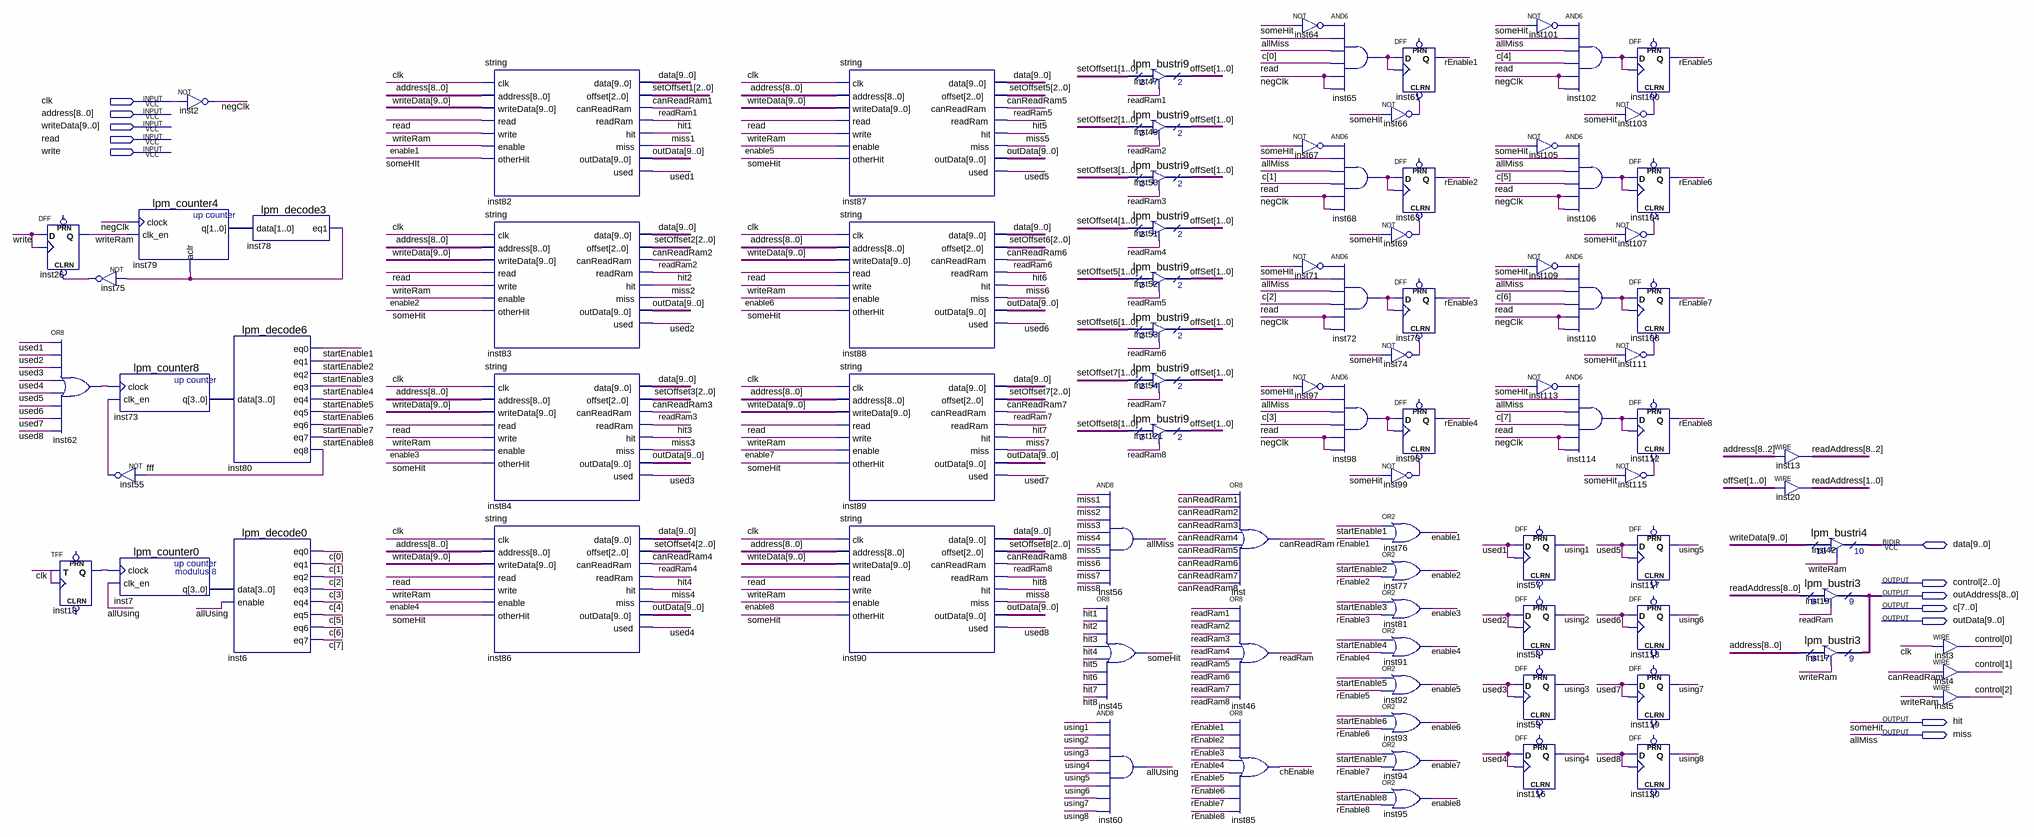
[diagram p0: schematic sheet]
// Quartus schematic Cache.bdf as structural Verilog: 90 symbols, 12 pins
module Cache (
  input  clk,
  input  [8:0] address,
  input  [9:0] writeData,
  input  read,
  input  write,
  inout  [9:0] data,
  output [2:0] control,
  output [8:0] outAddress,
  output [7:0] c,
  output [9:0] outData,
  output hit,
  output miss
);

  wire allUsing, canReadRam, canReadRam1, canReadRam2, canReadRam3, canReadRam4, canReadRam5, canReadRam6,
       canReadRam7, canReadRam8, chEnable, enable1, enable2, enable3, enable4, enable5, enable6, enable7,
       enable8, fff, hit1, hit2, hit3, hit4, hit5, hit6, hit7, hit8, inst18_q, inst55_out, inst62_out,
       inst64_out, inst65_out, inst66_out, inst67_out, inst68_out, inst69_out, inst71_out, inst72_out,
       inst74_out, inst75_out, inst78_eq1, inst97_out, inst98_out, inst99_out, inst101_out, inst102_out,
       inst103_out, inst105_out, inst106_out, inst107_out, inst109_out, inst110_out, inst111_out,
       inst113_out, inst114_out, inst115_out, miss1, miss2, miss3, miss4, miss5, miss6, miss7, miss8, negClk,
       readRam, readRam1, readRam2, readRam3, readRam4, readRam5, readRam6, readRam7, readRam8, rEnable1,
       rEnable2, rEnable3, rEnable4, rEnable5, rEnable6, rEnable7, rEnable8, startEnable1, startEnable2,
       startEnable3, startEnable4, startEnable5, startEnable6, startEnable7, startEnable8, used1, used2,
       used3, used4, used5, used6, used7, used8, using1, using2, using3, using4, using5, using6, using7,
       using8, writeRam;
  wire [1:0] inst79_q, offSet;
  wire [2:0] setOffset1, setOffset2, setOffset3, setOffset4, setOffset5, setOffset6, setOffset7, setOffset8;
  wire [3:0] inst7_q, inst73_q;
  wire [8:0] readAddress;

  DFF inst26 (.CLRN(inst75_out), .CLK(write), .D(write), .Q(writeRam));  // open: PRN
  or inst62 (inst62_out, used1, used2, used3, used4, used5, used6, used7, used8);
  TFF inst18 (.T(clk), .CLK(clk), .Q(inst18_q));  // open: PRN, CLRN
  not inst75 (inst75_out, inst78_eq1);
  lpm_counter8 inst73 (.clock(inst62_out), .clk_en(inst55_out), .q(inst73_q));
  not inst55 (inst55_out, fff);
  lpm_counter0 inst7 (.clock(inst18_q), .clk_en(allUsing), .q(inst7_q));
  lpm_counter4 inst79 (.clock(negClk), .clk_en(writeRam), .aclr(inst78_eq1), .q(inst79_q));
  not inst2 (negClk, clk);
  lpm_decode3 inst78 (.data(inst79_q), .eq1(inst78_eq1));
  lpm_decode6 inst80 (
    .data(inst73_q), .eq0(startEnable1), .eq1(startEnable2), .eq2(startEnable3), .eq3(startEnable4),
    .eq4(startEnable5), .eq5(startEnable6), .eq6(startEnable7), .eq7(startEnable8), .eq8(fff));
  lpm_decode0 inst6 (
    .data(inst7_q), .enable(allUsing), .eq0(c[0]), .eq1(c[1]), .eq2(c[2]), .eq3(c[3]), .eq4(c[4]),
    .eq5(c[5]), .eq6(c[6]), .eq7(c[7]));
  \string  inst82 (
    .clk(clk), .address(address), .writeData(writeData), .read(read), .write(writeRam), .enable(enable1),
    .otherHit(hit), .offset(setOffset1), .canReadRam(canReadRam1), .readRam(readRam1), .hit(hit1),
    .miss(miss1), .outData(outData), .used(used1), .data(data));
  \string  inst83 (
    .clk(clk), .address(address), .writeData(writeData), .read(read), .write(writeRam), .enable(enable2),
    .otherHit(hit), .offset(setOffset2), .canReadRam(canReadRam2), .readRam(readRam2), .hit(hit2),
    .miss(miss2), .outData(outData), .used(used2), .data(data));
  \string  inst84 (
    .clk(clk), .address(address), .writeData(writeData), .read(read), .write(writeRam), .enable(enable3),
    .otherHit(hit), .offset(setOffset3), .canReadRam(canReadRam3), .readRam(readRam3), .hit(hit3),
    .miss(miss3), .outData(outData), .used(used3), .data(data));
  \string  inst86 (
    .clk(clk), .address(address), .writeData(writeData), .read(read), .write(writeRam), .enable(enable4),
    .otherHit(hit), .offset(setOffset4), .canReadRam(canReadRam4), .readRam(readRam4), .hit(hit4),
    .miss(miss4), .outData(outData), .used(used4), .data(data));
  \string  inst87 (
    .clk(clk), .address(address), .writeData(writeData), .read(read), .write(writeRam), .enable(enable5),
    .otherHit(hit), .offset(setOffset5), .canReadRam(canReadRam5), .readRam(readRam5), .hit(hit5),
    .miss(miss5), .outData(outData), .used(used5), .data(data));
  \string  inst88 (
    .clk(clk), .address(address), .writeData(writeData), .read(read), .write(writeRam), .enable(enable6),
    .otherHit(hit), .offset(setOffset6), .canReadRam(canReadRam6), .readRam(readRam6), .hit(hit6),
    .miss(miss6), .outData(outData), .used(used6), .data(data));
  \string  inst89 (
    .clk(clk), .address(address), .writeData(writeData), .read(read), .write(writeRam), .enable(enable7),
    .otherHit(hit), .offset(setOffset7), .canReadRam(canReadRam7), .readRam(readRam7), .hit(hit7),
    .miss(miss7), .outData(outData), .used(used7), .data(data));
  \string  inst90 (
    .clk(clk), .address(address), .writeData(writeData), .read(read), .write(writeRam), .enable(enable8),
    .otherHit(hit), .offset(setOffset8), .canReadRam(canReadRam8), .readRam(readRam8), .hit(hit8),
    .miss(miss8), .outData(outData), .used(used8), .data(data));
  and inst56 (miss, miss1, miss2, miss3, miss4, miss5, miss6, miss7, miss8);
  or inst45 (hit, hit1, hit2, hit3, hit4, hit5, hit6, hit7, hit8);
  and inst60 (allUsing, using1, using2, using3, using4, using5, using6, using7, using8);
  lpm_bustri9 inst47 (.enabledt(readRam1), .data(setOffset1[1:0]), .tridata(offSet));
  lpm_bustri9 inst49 (.enabledt(readRam2), .data(setOffset2[1:0]), .tridata(offSet));
  lpm_bustri9 inst50 (.enabledt(readRam3), .data(setOffset3[1:0]), .tridata(offSet));
  lpm_bustri9 inst51 (.enabledt(readRam4), .data(setOffset4[1:0]), .tridata(offSet));
  lpm_bustri9 inst52 (.enabledt(readRam5), .data(setOffset5[1:0]), .tridata(offSet));
  lpm_bustri9 inst53 (.enabledt(readRam6), .data(setOffset6[1:0]), .tridata(offSet));
  lpm_bustri9 inst54 (.enabledt(readRam7), .data(setOffset7[1:0]), .tridata(offSet));
  lpm_bustri9 inst121 (.enabledt(readRam8), .data(setOffset8[1:0]), .tridata(offSet));
  or inst (canReadRam, canReadRam1, canReadRam2, canReadRam3, canReadRam4, canReadRam5, canReadRam6, canReadRam7, canReadRam8);
  or inst46 (readRam, readRam1, readRam2, readRam3, readRam4, readRam5, readRam6, readRam7, readRam8);
  or inst85 (chEnable, rEnable1, rEnable2, rEnable3, rEnable4, rEnable5, rEnable6, rEnable7, rEnable8);
  not inst64 (inst64_out, hit);
  not inst67 (inst67_out, hit);
  not inst71 (inst71_out, hit);
  not inst97 (inst97_out, hit);
  and inst65 (inst65_out, inst64_out, miss, c[0], read, negClk, negClk);
  and inst68 (inst68_out, inst67_out, miss, c[1], read, negClk, negClk);
  and inst72 (inst72_out, inst71_out, miss, c[2], read, negClk, negClk);
  and inst98 (inst98_out, inst97_out, miss, c[3], read, negClk, negClk);
  DFF inst61 (.CLRN(inst66_out), .CLK(inst65_out), .D(inst65_out), .Q(rEnable1));  // open: PRN
  not inst66 (inst66_out, hit);
  DFF inst63 (.CLRN(inst69_out), .CLK(inst68_out), .D(inst68_out), .Q(rEnable2));  // open: PRN
  not inst69 (inst69_out, hit);
  DFF inst70 (.CLRN(inst74_out), .CLK(inst72_out), .D(inst72_out), .Q(rEnable3));  // open: PRN
  not inst74 (inst74_out, hit);
  DFF inst96 (.CLRN(inst99_out), .CLK(inst98_out), .D(inst98_out), .Q(rEnable4));  // open: PRN
  not inst99 (inst99_out, hit);
  or inst76 (enable1, startEnable1, rEnable1);
  or inst77 (enable2, startEnable2, rEnable2);
  or inst81 (enable3, startEnable3, rEnable3);
  or inst91 (enable4, startEnable4, rEnable4);
  or inst92 (enable5, startEnable5, rEnable5);
  or inst93 (enable6, startEnable6, rEnable6);
  or inst94 (enable7, startEnable7, rEnable7);
  or inst95 (enable8, startEnable8, rEnable8);
  not inst101 (inst101_out, hit);
  not inst105 (inst105_out, hit);
  not inst109 (inst109_out, hit);
  not inst113 (inst113_out, hit);
  DFF inst57 (.CLK(used1), .D(used1), .Q(using1));  // open: CLRN, PRN
  DFF inst58 (.CLK(used2), .D(used2), .Q(using2));  // open: CLRN, PRN
  DFF inst59 (.CLK(used3), .D(used3), .Q(using3));  // open: CLRN, PRN
  DFF inst116 (.CLK(used4), .D(used4), .Q(using4));  // open: CLRN, PRN
  and inst102 (inst102_out, inst101_out, miss, c[4], read, negClk, negClk);
  and inst106 (inst106_out, inst105_out, miss, c[5], read, negClk, negClk);
  and inst110 (inst110_out, inst109_out, miss, c[6], read, negClk, negClk);
  and inst114 (inst114_out, inst113_out, miss, c[7], read, negClk, negClk);
  DFF inst100 (.CLRN(inst103_out), .CLK(inst102_out), .D(inst102_out), .Q(rEnable5));  // open: PRN
  not inst103 (inst103_out, hit);
  DFF inst104 (.CLRN(inst107_out), .CLK(inst106_out), .D(inst106_out), .Q(rEnable6));  // open: PRN
  not inst107 (inst107_out, hit);
  DFF inst108 (.CLRN(inst111_out), .CLK(inst110_out), .D(inst110_out), .Q(rEnable7));  // open: PRN
  not inst111 (inst111_out, hit);
  DFF inst112 (.CLRN(inst115_out), .CLK(inst114_out), .D(inst114_out), .Q(rEnable8));  // open: PRN
  not inst115 (inst115_out, hit);
  DFF inst117 (.CLK(used5), .D(used5), .Q(using5));  // open: CLRN, PRN
  DFF inst118 (.CLK(used6), .D(used6), .Q(using6));  // open: CLRN, PRN
  DFF inst119 (.CLK(used7), .D(used7), .Q(using7));  // open: CLRN, PRN
  DFF inst120 (.CLK(used8), .D(used8), .Q(using8));  // open: CLRN, PRN
  assign readAddress[8:2] = address[8:2];  // WIRE inst13
  assign readAddress[1:0] = offSet;  // WIRE inst20
  lpm_bustri4 inst42 (.enabledt(writeRam), .data(writeData), .tridata(data));
  lpm_bustri3 inst19 (.enabledt(readRam), .data(readAddress), .tridata(outAddress));
  lpm_bustri3 inst17 (.enabledt(writeRam), .data(address), .tridata(outAddress));
  assign control[0] = clk;  // WIRE inst3
  assign control[1] = canReadRam;  // WIRE inst4
  assign control[2] = writeRam;  // WIRE inst5

  // Other names for the same wires on the sheet: allMiss = miss; someHIt = hit
endmodule
